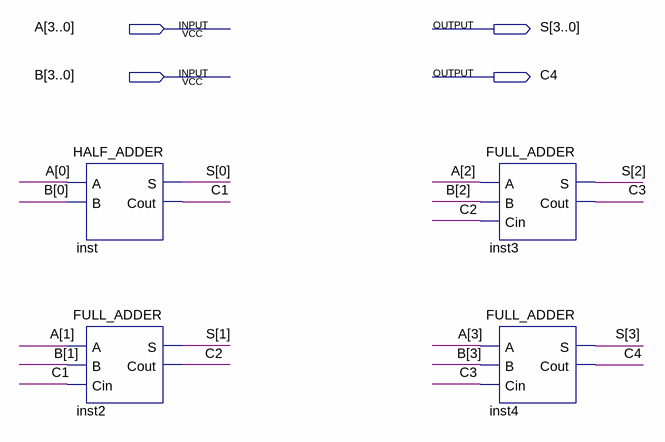
[diagram p0: schematic sheet]
// Quartus schematic RCA_4_BITS.bdf as structural Verilog: 4 symbols, 4 pins
module RCA_4_BITS (
  input  [3:0] A,
  input  [3:0] B,
  output [3:0] S,
  output C4
);

  wire C1, C2, C3;

  HALF_ADDER inst (.A(A[0]), .B(B[0]), .S(S[0]), .Cout(C1));
  FULL_ADDER inst2 (.A(A[1]), .B(B[1]), .Cin(C1), .S(S[1]), .Cout(C2));
  FULL_ADDER inst3 (.A(A[2]), .B(B[2]), .Cin(C2), .S(S[2]), .Cout(C3));
  FULL_ADDER inst4 (.A(A[3]), .B(B[3]), .Cin(C3), .S(S[3]), .Cout(C4));
endmodule
